# Altium schematic sheet Sheet2.SchDoc
size A4
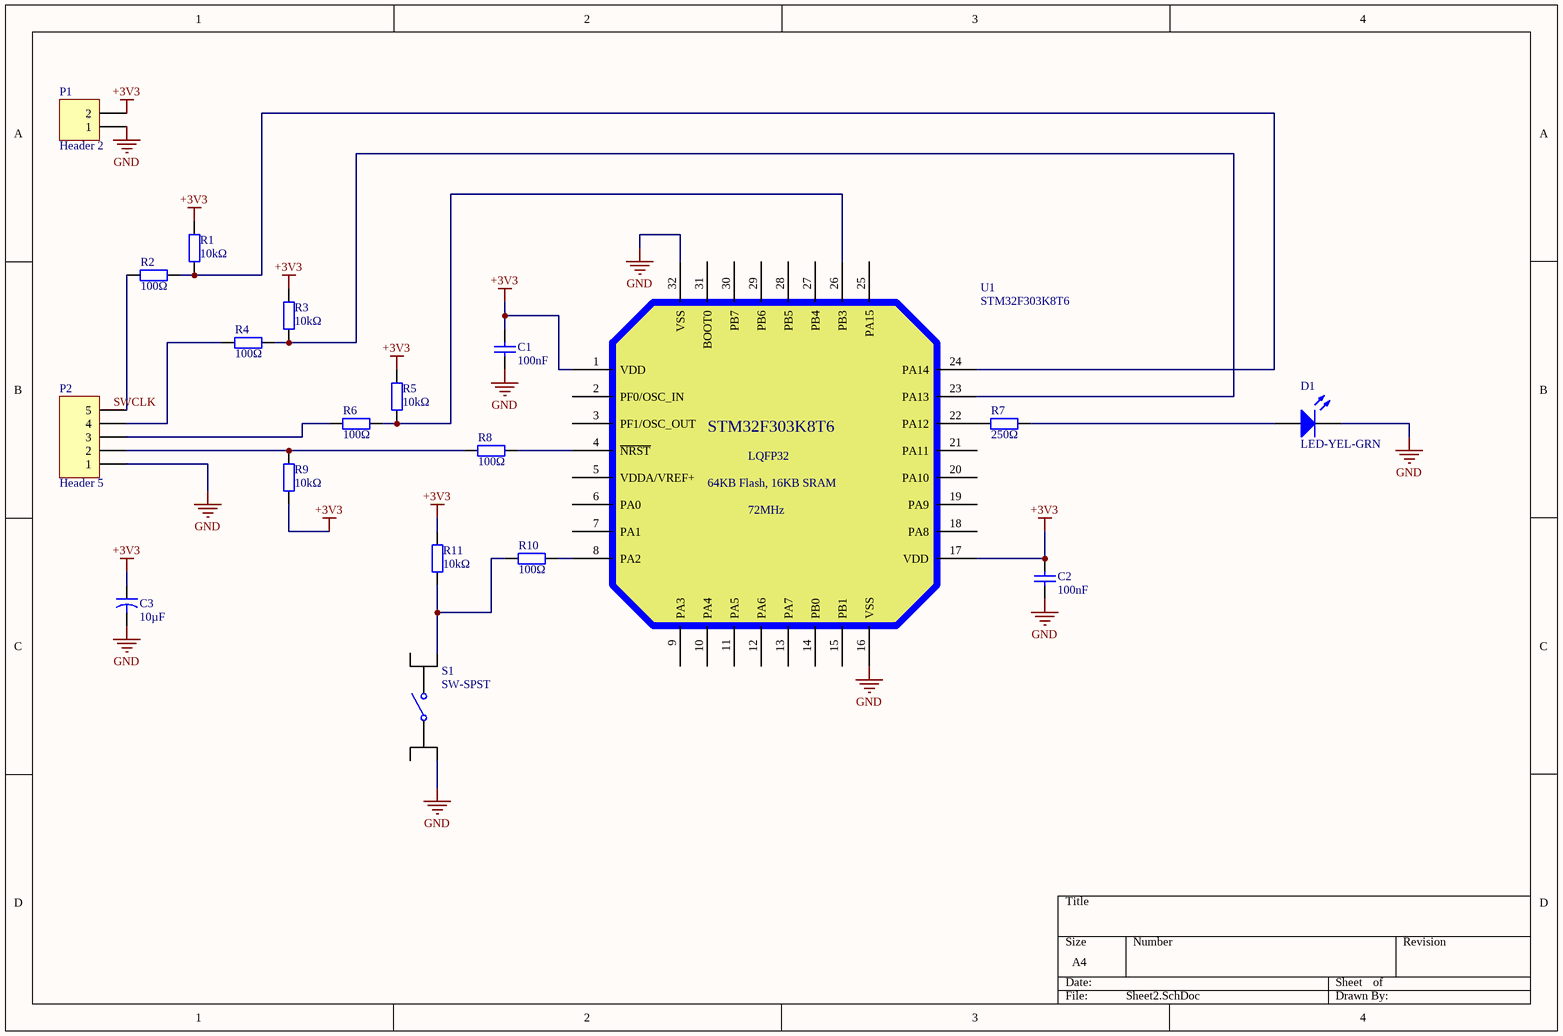
[diagram p0: Sheet2.SchDoc]

## Parts
C1  100nF  [capacitor0603nopolar]
C2  100nF  [capacitor0603nopolar]
C3  Capacity: 10µF  [cappolar_CM1H106M6L006VR]  (hidden comment: Cap 10uF)
D1  LED-YEL-GRN  [diode0603]
P1  Header 2  [header2,54]
P2  Header 5  [HDR1X5]
R1  10kΩ  [resistor0603]
R2  100Ω  [resistor0603]
R3  10kΩ  [resistor0603]
R4  100Ω  [resistor0603]
R5  10kΩ  [resistor0603]
R6  100Ω  [resistor0603]
R7  Resistance: 250Ω  [resistor0603]  (hidden comment: 604Ω)
R8  100Ω  [resistor0603]
R9  10kΩ  [resistor0603]
R10  100Ω  [resistor0603]
R11  10kΩ  [resistor0603]
S1  SW-SPST  [switch]
U1  STM32F303K8T6  [STM32F303K8T6]

## Nets
+3V3: C1.2 C2.2 C3.1 P1.2 R1.2 R3.2 R5.2 R9.2 R11.2 U1.1(VDD) U1.17(VDD)
GND: C1.1 C2.1 C3.2 D1.2(K) P1.1 P2.1 S1.2(NO) U1.16(VSS) U1.32(VSS)
NetD1_1: D1.1(A) R7.2
NetP2_2: P2.2 R8.1 R9.1
NetP2_3: P2.3 R6.1
NetP2_4: P2.4 R4.1
NetP2_5: P2.5 R2.1
NetR1_1: R1.1 R2.2 U1.24(PA14)
NetR3_1: R3.1 R4.2 U1.23(PA13)
NetR5_1: R5.1 R6.2 U1.26(PB3)
NetR7_1: R7.1 U1.22(PA12)
NetR8_2: R8.2 U1.4(~{NRST})
NetR10_1: R10.1 R11.1 S1.4(NO)
NetR10_2: R10.2 U1.8(PA2)

Not connected (* = marked no-connect by the designer): S1 1(NO) 3(NO); U1 2(PF0/OSC_IN) 3(PF1/OSC_OUT) 5(VDDA/VREF+) 6(PA0) 7(PA1) 9(PA3) 10(PA4) 11(PA5) 12(PA6) 13(PA7) 14(PB0) 15(PB1) 18(PA8) 19(PA9) 20(PA10) 21(PA11) 25(PA15) 27(PB4) 28(PB5) 29(PB6) 30(PB7) 31(BOOT0)

## Notes on the sheet
- Labels drawn without touching a wire or pin: SWCLK
- (in symbol STM32F303K8T6) 64KB Flash, 16KB SRAM

## Library data of the parts
C1 C2 = Cap 100nF: Capacitor; Manufacturer: WALSIN; Manufacturer symbol: 0603B104K101CT; Voltage: 100V; Tolerance: ±10%; Supplier symbol: 0603B104K101CT; Supplier: tme.pl; Package: 0603; Temperature: -55...125°C; Value: 100nF
C3 = Cap 10uF: Capacitor; Manufacturer symbol: CM1H106M6L006VR; Manufacturer: SAMWHA; Tolerance: ±20%; Voltage: 50V; Temperature: -55...105°C; Supplier symbol: CM1H106M6L006VR; Supplier: tme.pl; Size: Ø6,3x5,8mm
D1 = LED-YEL-GRN: Typical INFRARED GaAs LED; Manufacturer symbol: 19-21SYGC/S530-E1/4T; Manufacturer: EVERLIGHT; Color: żółto-zielony; Current: 20mA; Voltage: 1,7...2,4V; Supplier symbol: 19-21SYGC/S530-E1; Supplier: tme.pl; Package: 0603
P1 = Header 2: Header, 2-Pin; Manufacturer: TE CONNECTIVITY; Manufacturer symbol: 825433-2; Montage: THT; Supplier: tme.pl; Supplier symbol: 825433-2; Type: Male; Pins: 2; Orientation: Straight
P2 = Header 5: Header, 5-Pin; LatestRevisionDate: 17-Jul-2002; LatestRevisionNote: Re-released for DXP Platform.; Publisher: Altium Limited
R1 R3 R5 R9 R11 = Resistor 10Kohm: Resistor; Manufacturer: ROYAL OHM; Manufacturer symbol: HP03W5F1002T5E; Montage: SMD; Tolerance: ±1%; Voltage: 50V; Supplier symbol: HP03-10K1%; Supplier: tme.pl; Type: thick film; Resistance: 10kΩ; Temperature: -55...155°C; Package: 0603
R2 R4 R6-R8 R10 = Resistor 604ohm: Resistor; Manufacturer: WALSIN; Manufacturer symbol: WR06X6040FTL; Montage: SMD; Tolerance: ±1%; Voltage: 75V; Supplier symbol: WR06X6040FTL; Supplier: tme.pl; Type: thick film; Temperature: -55...155°C; Package: 0603
  R2 R4 R6 R8 R10: Resistance: 100Ω
S1 = SW-SPST: Single-Pole, Single-Throw Switch; Manufacturer symbol: HP0315AFKP2-S; Manufacturer: NKK SWITCHES; Supplier: tme.pl; Supplier symbol: HP0315AFKP2-S; Temperature: -20...70°C; Dimensions: 6,2x6,2x4,4mm; Height: 4,4mm
U1 = STM32F303K8T6: Microchip; Manufacturer: STMicroelectronics; Frequency: 72MHz; Montage: SMD; I/O: 10; Architecture: Cortex M4; Supplier symbol: STM32F303K8T6; Manufacturer symbol: STM32F303K8T6; Type: mikrokontroler ARM; Package: LQFP32; Temperature: -40...85°C; Supplier: tme.eu